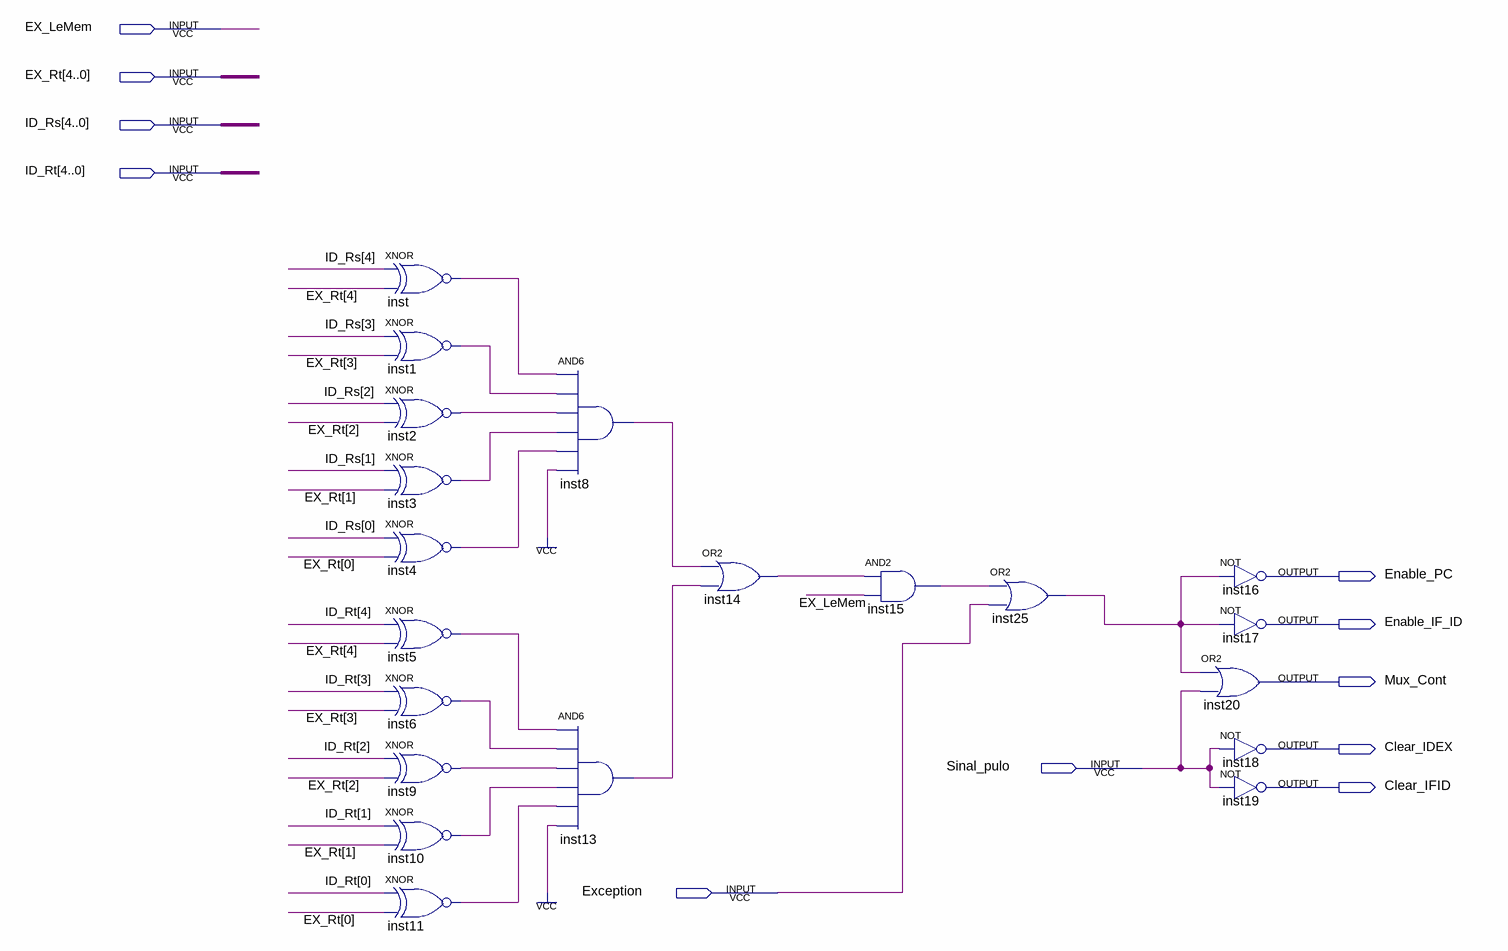
[diagram p0: schematic sheet]
// Quartus schematic cont_hazard.bdf as structural Verilog: 20 symbols, 11 pins
module cont_hazard (
  input  EX_LeMem,
  input  [4:0] EX_Rt,
  input  [4:0] ID_Rs,
  input  [4:0] ID_Rt,
  input  Sinal_pulo,
  input  Exception,
  output Enable_PC,
  output Enable_IF_ID,
  output Mux_Cont,
  output Clear_IDEX,
  output Clear_IFID
);

  wire inst1_out, inst2_out, inst3_out, inst4_out, inst5_out, inst6_out, inst8_out, inst9_out, inst10_out,
       inst11_out, inst13_out, inst14_out, inst15_out, inst25_out, inst_out;

  xnor inst (inst_out, ID_Rs[4], EX_Rt[4]);
  xnor inst1 (inst1_out, ID_Rs[3], EX_Rt[3]);
  xnor inst2 (inst2_out, ID_Rs[2], EX_Rt[2]);
  xnor inst3 (inst3_out, ID_Rs[1], EX_Rt[1]);
  xnor inst4 (inst4_out, ID_Rs[0], EX_Rt[0]);
  xnor inst5 (inst5_out, ID_Rt[4], EX_Rt[4]);
  xnor inst6 (inst6_out, ID_Rt[3], EX_Rt[3]);
  xnor inst9 (inst9_out, ID_Rt[2], EX_Rt[2]);
  xnor inst10 (inst10_out, ID_Rt[1], EX_Rt[1]);
  xnor inst11 (inst11_out, ID_Rt[0], EX_Rt[0]);
  and inst8 (inst8_out, inst_out, inst1_out, inst2_out, inst3_out, inst4_out, 1'b1);
  and inst13 (inst13_out, inst5_out, inst6_out, inst9_out, inst10_out, inst11_out, 1'b1);
  or inst14 (inst14_out, inst8_out, inst13_out);
  and inst15 (inst15_out, inst14_out, EX_LeMem);
  or inst25 (inst25_out, inst15_out, Exception);
  not inst16 (Enable_PC, inst25_out);
  not inst17 (Enable_IF_ID, inst25_out);
  or inst20 (Mux_Cont, inst25_out, Sinal_pulo);
  not inst18 (Clear_IDEX, Sinal_pulo);
  not inst19 (Clear_IFID, Sinal_pulo);
endmodule
